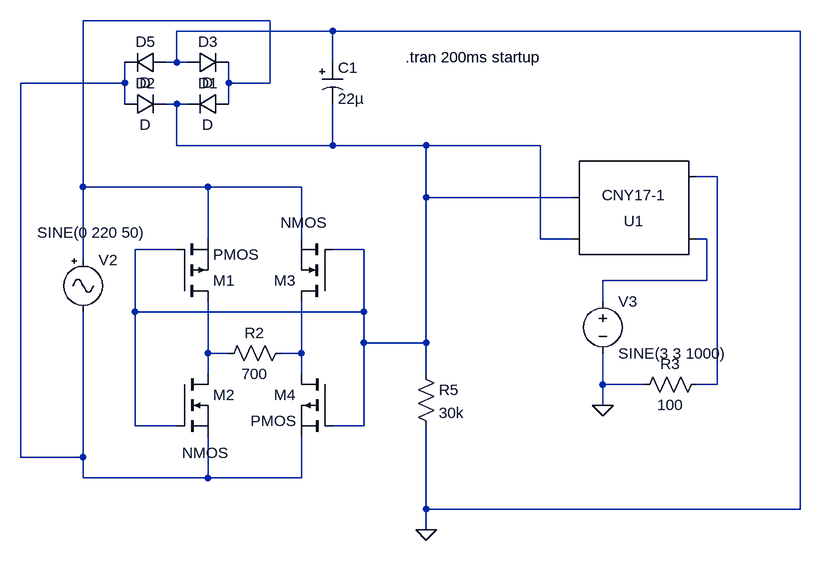
[diagram p0: schematic mosfet_ac_switch3.asc]
mosfet_ac_switch3.asc, the LTspice schematic file:
Version 4
SHEET 1 1588 736
WIRE 240 -128 -48 -128
WIRE 336 -112 96 -112
WIRE 1056 -112 336 -112
WIRE 96 -64 96 -112
WIRE 96 -64 80 -64
WIRE 112 -64 96 -64
WIRE 336 -64 336 -112
WIRE 16 -32 16 -64
WIRE 16 -32 -144 -32
WIRE 176 -32 176 -64
WIRE 240 -32 240 -128
WIRE 240 -32 176 -32
WIRE 16 0 16 -32
WIRE 96 0 80 0
WIRE 112 0 96 0
WIRE 176 0 176 -32
WIRE 96 64 96 0
WIRE 336 64 336 0
WIRE 336 64 96 64
WIRE 480 64 336 64
WIRE 656 64 480 64
WIRE 928 112 896 112
WIRE -48 128 -48 -128
WIRE 144 128 -48 128
WIRE 288 128 144 128
WIRE 480 144 480 64
WIRE 704 144 480 144
WIRE 144 208 144 128
WIRE 288 208 288 128
WIRE 656 208 656 64
WIRE 704 208 656 208
WIRE 912 208 896 208
WIRE 96 224 32 224
WIRE 384 224 336 224
WIRE -48 240 -48 128
WIRE 912 272 912 208
WIRE 912 272 752 272
WIRE 752 304 752 272
WIRE 32 320 32 224
WIRE 384 320 384 224
WIRE 384 320 32 320
WIRE 384 368 384 320
WIRE 480 368 480 144
WIRE 480 368 384 368
WIRE 144 384 144 304
WIRE 176 384 144 384
WIRE 288 384 288 304
WIRE 288 384 256 384
WIRE 144 416 144 384
WIRE 288 416 288 384
WIRE 480 416 480 368
WIRE 752 432 752 384
WIRE 816 432 752 432
WIRE 928 432 928 112
WIRE 928 432 896 432
WIRE 752 464 752 432
WIRE 32 496 32 320
WIRE 96 496 32 496
WIRE 384 496 384 368
WIRE 384 496 336 496
WIRE -144 544 -144 -32
WIRE -48 544 -48 320
WIRE -48 544 -144 544
WIRE -48 576 -48 544
WIRE 144 576 144 512
WIRE 144 576 -48 576
WIRE 288 576 288 512
WIRE 288 576 144 576
WIRE 480 624 480 496
WIRE 1056 624 1056 -112
WIRE 1056 624 480 624
WIRE 480 656 480 624
FLAG 752 464 0
FLAG 480 656 0
SYMBOL Misc/signal -48 224 R0
WINDOW 3 -71 -26 Left 2
SYMATTR InstName V2
SYMATTR Value SINE(0 220 50)
SYMBOL res 160 400 R270
WINDOW 0 32 56 VTop 2
WINDOW 3 0 56 VBottom 2
SYMATTR InstName R2
SYMATTR Value 700
SYMBOL Optos/CNY17-1 800 144 R180
SYMATTR InstName U1
SYMBOL nmos 96 416 R0
WINDOW 3 8 121 Left 2
SYMATTR InstName M2
SYMBOL voltage 752 288 R0
SYMATTR InstName V3
SYMATTR Value SINE(3 3 1000)
SYMBOL res 912 416 R90
WINDOW 0 0 56 VBottom 2
WINDOW 3 32 56 VTop 2
SYMATTR InstName R3
SYMATTR Value 100
SYMBOL diode 176 -16 R90
WINDOW 0 0 32 VBottom 2
WINDOW 3 32 32 VTop 2
SYMATTR InstName D1
SYMBOL res 464 400 R0
SYMATTR InstName R5
SYMATTR Value 30k
SYMBOL diode 16 16 R270
WINDOW 0 32 32 VTop 2
WINDOW 3 0 32 VBottom 2
SYMATTR InstName D2
SYMBOL diode 112 -48 R270
WINDOW 0 32 32 VTop 2
WINDOW 3 0 32 VBottom 2
SYMATTR InstName D3
SYMBOL diode 80 -80 R90
WINDOW 0 0 32 VBottom 2
WINDOW 3 32 32 VTop 2
SYMATTR InstName D5
SYMBOL Misc/EuropeanPolcap 320 -64 R0
SYMATTR InstName C1
SYMATTR Value 22µ
SYMBOL pmos 96 304 M180
SYMATTR InstName M1
SYMBOL nmos 336 304 R180
WINDOW 3 8 121 Left 2
SYMATTR InstName M3
SYMBOL pmos 336 416 M0
SYMATTR InstName M4
TEXT 448 -72 Left 2 !.tran 200ms startup

The netlist it stands for:
* mosfet_ac_switch3.asc
V2 N001 N002 SINE(0 220 50)
R2 N006 N007 700
XU1 N005 N004 N003 N003 NC_01 CNY17 Igain=.724m
M2 N006 N003 N002 N002 NMOS
V3 N005 0 SINE(3 3 1000)
R3 N004 0 100
D1 N001 N003 D
R5 N003 0 30k
D2 N002 N003 D
D3 0 N001 D
D5 0 N002 D
C1 0 N003 22µ
M1 N006 N003 N001 N001 PMOS
M3 N007 N003 N001 N001 NMOS
M4 N007 N003 N002 N002 PMOS
.model D D
.lib standard.dio
.model NMOS NMOS
.model PMOS PMOS
.lib standard.mos
.tran 200ms startup
.lib CNY17.sub
.backanno
.end